# Altium schematic sheet DebugBreakout.SchDoc: Debug Breakout Board
size A3; Organization: INTERCREATE; Address1: 2415 3RD ST. SUITE #232; Address2: SAN FRANCISCO CA 94107; Revision: C; SheetNumber: 1; SheetTotal: 1; ProjectName: KAGWERKS COMMAND CENTER
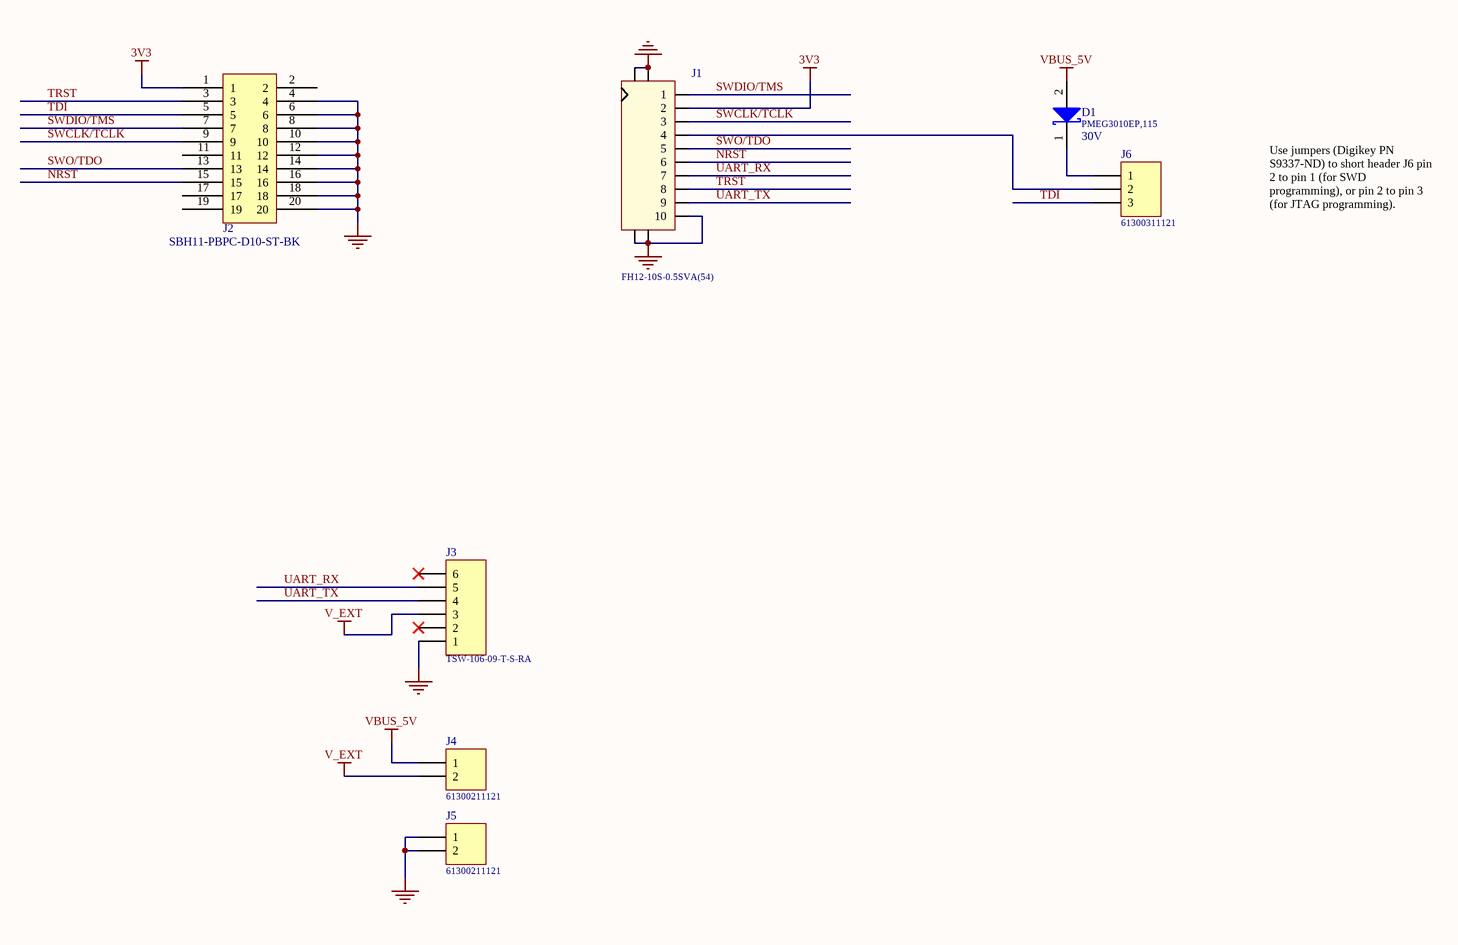
[diagram p0: DebugBreakout.SchDoc]

## Parts
D1  PMEG3010EP,115  Reverse Voltage: 30V  [DIODE-SOD128]
J1  FH12-10S-0.5SVA(54)  [CONN-V-FPC-10P FH12-10S-0.5SVA(54)]
J2  SBH11-PBPC-D10-ST-BK  [HDR-V-2x10-KEYED]
J3  TSW-106-09-T-S-RA  [HDR-RA-1X6]
J4  61300211121  [HDR-V-1X2]
J5  61300211121  [HDR-V-1X2]
J6  61300311121  [HDR-V-1X3]

## Nets
3V3: J1.2 J2.1
GND: J1.10 J1.ME1 J1.ME2 J1.ME3 J1.ME4 J2.4 J2.6 J2.8 J2.10 J2.12 J2.14 J2.16 J2.18 J2.20 J3.1 J5.1 J5.2
V_EXT: J3.3 J4.2
VBUS_5V: D1.2(A) J4.1
NRST: J1.6 J2.15
SWCLK/TCLK: J1.3 J2.9
SWDIO/TMS: J1.1 J2.7
SWO/TDO: J1.5 J2.13
TDI: J2.5 J6.3
TRST: J1.8 J2.3
UART_RX: J1.7 J3.5
UART_TX: J1.9 J3.4
NetD1_1: D1.1(K) J6.1
NetJ1_4: J1.4 J6.2

Not connected (* = marked no-connect by the designer): J2 2 11 17 19; J3 2* 6*

## Notes on the sheet
- Use jumpers (Digikey PN S9337-ND) to short header J6 pin 2 to pin 1 (for SWD programming), or pin 2 to pin 3 (for JTAG programming).
- Title
- Size:
- Date:
- A3
- Number:
- Time:
- Revision:
- Sheet
- of
- File:

## Library data of the parts
D1 = DIODE-SCHOTTKY-30V-1A-SOD128: DIODE SCHOTTKY 30V 1A SOD128; Manufacturer 1: Nexperia USA Inc.; Speed: Fast Recovery =< 500ns, > 200mA (Io); Capacitance @ Vr, F: 170pF @ 1V, 1MHz; Supplier 1: Digi-Key; Manufacturer Part Number 1: PMEG3010EP,115; RoHS: RoHS Compliant; Category: Discrete Semiconductor Products; Stock 1: 0; Pricing 1: 3000=0.11556, 6000=0.10856, 15000=0.10155, 30000=0.09338 (USD); Packaging: Tape & Reel (TR); Part Status: Active; Diode Type: Schottky; Current - Average Rectified (Io): 1A; Mounting Type: Surface Mount; Package / Case: SOD-128; Supplier Device Package: CFP5; Operating Temperature - Junction: 150°C (Max); Base Part Number: PMEG3010; ComponentLink1URL: https://assets.nexperia.com/documents/data-sheet/PMEG3010EP.pdf; ComponentLink1Description: https://assets.nexperia.com/documents/data-sheet/PMEG3010EP.pdf; Supplier Part Number 1: 1727-5408-1-ND
J1 = CONN-V-FPC-10P-0.5MM: CONN FFC VERT 10POS 0.50MM SMD; Manufacturer 1: Hirose; Actuator Material: Polyphenylene; Number of Positions: 10; Voltage Rating: 50V; Current Rating: 500mA; Gender: Receptacle; Wire/Cable Type: Straight; Mating Cycles: 20; Insulation Resistance: 500MR; Contact Resistance: 50mR; Pitch: 0.02inch; Supplier 1: Digi-Key; Manufacturer Part Number 1: FH12-10S-0.5SVA(54); Stock 1: 1442; Pricing 1: 1=1.18000, 10=1.03800, 25=0.97680, 50=0.93620, 100=0.89540, 250=0.81400, 500=0.73260 (USD); RoHS: Yes; Mount: Surface Mount; Contact Material: Bronze; Contact Plating: Gold; Housing Material: Nylon; Material: Nylon; Min Operating Temperature: -40°C; Max Operating Temperature: 85°C; Package Quantity: 1000; Packaging: Tape and Reel; Termination: Solder; Number of Rows: 1; REACH SVHC: Unknown; Flammability Rating: UL94 V-0; Lead Free: Lead Free; ComponentLink1URL: https://datasheet.ciiva.com/18554/fh12-18554796.pdf?src-supplier=Digi-Key; ComponentLink1Description: https://datasheet.ciiva.com/18554/fh12-18554796.pdf?src-supplier=Digi-Key; ComponentLink2URL: https://datasheet.ciiva.com/13702/ed-fh12-20140305-355586-13702565.pdf?src-supplier=Mouser; ComponentLink2Description: https://datasheet.ciiva.com/13702/ed-fh12-20140305-355586-13702565.pdf?src-supplier=Mouser; Supplier Part Number 1: H125134CT-ND
J2 = HDR-V-2x10-M: CONN HEADER VERT 20POS 2.54MM; Manufacturer 1: Sullins; Number of Positions: 20; Connector Type: Male Pin; Pitch: 0.1inch; Supplier 1: Digi-Key; Manufacturer Part Number 1: SBH11-PBPC-D10-ST-BK; Stock 1: 23438; Pricing 1: 1=0.54000, 10=0.51000, 100=0.39120, 500=0.34020, 1000=0.28067, 5000=0.24665, 10000=0.24570 (USD); RoHS: Yes; Mount: Through Hole; Color: Black; Contact Plating: Gold; Package Quantity: 1; Number of Rows: 2; Packaging: Tray; Termination: Solder; Row Spacing: 0.1inch; Lead Free: Lead Free; ComponentLink1URL: https://datasheet.ciiva.com/730/sbh11-pbpc-dxx-st-xx-730919.pdf?src-supplier=Digi-Key; ComponentLink1Description: https://datasheet.ciiva.com/730/sbh11-pbpc-dxx-st-xx-730919.pdf?src-supplier=Digi-Key; Supplier Part Number 1: S9172-ND
J3 = HDR-RA-1X6-M: Conn Unshrouded Header HDR 6 POS 2.54mm Solder RA Thru-Hole Automotive Bulk; Manufacturer 1: Samtec; Number of Positions: 6; Gender: Male; Connector Type: Male Pin; Max Current Rating: 7.6A; Max Voltage Rating (AC): 450V; Supplier 1: Digi-Key; Manufacturer Part Number 1: TSW-106-09-T-S-RA; Stock 1: 1097; Pricing 1: 1=0.46000, 10=0.43500, 100=0.33350, 500=0.29000, 1000=0.23925, 5000=0.21025, 10000=0.19575 (USD); RoHS: Yes; Mount: Through Hole; Contact Plating: Tin; Contact Material: Bronze; Housing Material: Polyester; Color: Black; Min Operating Temperature: -55°C; Max Operating Temperature: 105°C; Number of Rows: 1; Packaging: Bulk; Termination: Solder; Number of Contacts: 6; Pitch: 2.54mm; Contact Mating Length: 0.23inch; REACH SVHC: No SVHC; ComponentLink1URL: https://datasheet.ciiva.com/48560/htsw-th-48560268.pdf?src-supplier=Avnet; ComponentLink1Description: https://datasheet.ciiva.com/48560/htsw-th-48560268.pdf?src-supplier=Avnet; ComponentLink2URL: https://datasheet.ciiva.com/739/tsw-xxx-xx-xxx-x-xx-xxx-mkt-739950.pdf?src-supplier=Digi-Key; ComponentLink2Description: https://datasheet.ciiva.com/739/tsw-xxx-xx-xxx-x-xx-xxx-mkt-739950.pdf?src-supplier=Digi-Key; Supplier Part Number 1: SAM15949-ND; Category: Headers and Wire Housings; Housing Color: Black; Orientation: Right Angle; Length: 15.24mm; Depth: 9.9mm; Radiation Hardening: No
J4 J5 = HDR-V-1X2-M: Header, 2-Pin, 0.1"; Manufacturer: Wurth Electronics; Current Rating: 3A; Voltage Rating: 250V; Number of Positions: 2; Gender: Male; Connector Type: Male Pin; Pitch: 0.1inch; LatestRevisionDate: 17-Jul-2002; LatestRevisionNote: Re-released for DXP Platform.; Publisher: Altium Limited; Supplier 1: Digi-Key; MPN: 61300211121; Stock 1: 88010; Pricing 1: 1=0.13, 10=0.106, 25=0.088, 50=0.074, 100=0.067, 1000=0.061 (USD); Mount: Through Hole; Contact Plating: Gold; Housing Material: PBT; Contact Material: Copper,Copper Alloy; Colour: Black; Min Operating Temperature: -40°C; Max Operating Temperature: 125°C; Number of Rows: 1; Contact Gender: Male; Packaging: Bulk; Termination: Through Hole; Number of Contacts: 2; Contact Mating Length: 0.236inch; REACH SVHC: Unknown; Lead Free: Lead Free; ComponentLink1URL: https://datasheet.ciiva.com/13619/6130xx11121-48870-13619345.pdf; ComponentLink1Description: https://datasheet.ciiva.com/13619/6130xx11121-48870-13619345.pdf; Supplier Part Number 1: 732-5315-ND; Manufacturer 1: Wurth Electronics; Manufacturer Part Number 1: 61300211121
J6 = HDR-V-1X3-M: Header, 3-Pin, 0.1"; Manufacturer: Wurth Electronics; Number of Positions: 3; Gender: Male; Connector Type: Male Pin; Pitch: 0.1inch; LatestRevisionDate: 17-Jul-2002; LatestRevisionNote: Re-released for DXP Platform.; Publisher: Altium Limited; Supplier 1: Digi-Key; MPN: 61300311121; Stock 1: 41782; Pricing 1: 1=0.13, 10=0.106, 25=0.088, 50=0.074, 100=0.067, 1000=0.061 (USD); Mount: Through Hole; Contact Plating: Gold; Contact Material: Copper; Colour: Black; Number of Rows: 1; Packaging: Bulk; Termination: Solder; Number of Contacts: 3; Contact Mating Length: 0.236inch; REACH SVHC: Unknown; Lead Free: Lead Free; ComponentLink1URL: http://www.farnell.com/cad/1737268.pdf; ComponentLink1Description: http://www.farnell.com/cad/1737268.pdf; ComponentLink2URL: http://katalog.we-online.de/em/datasheet/6130xx11121.pdf; ComponentLink2Description: http://katalog.we-online.de/em/datasheet/6130xx11121.pdf; Supplier Part Number 1: 732-5316-ND; Manufacturer 1: Wurth Electronics; Manufacturer Part Number 1: 61300311121